# Altium schematic sheet Sheet1.SchDoc
size A
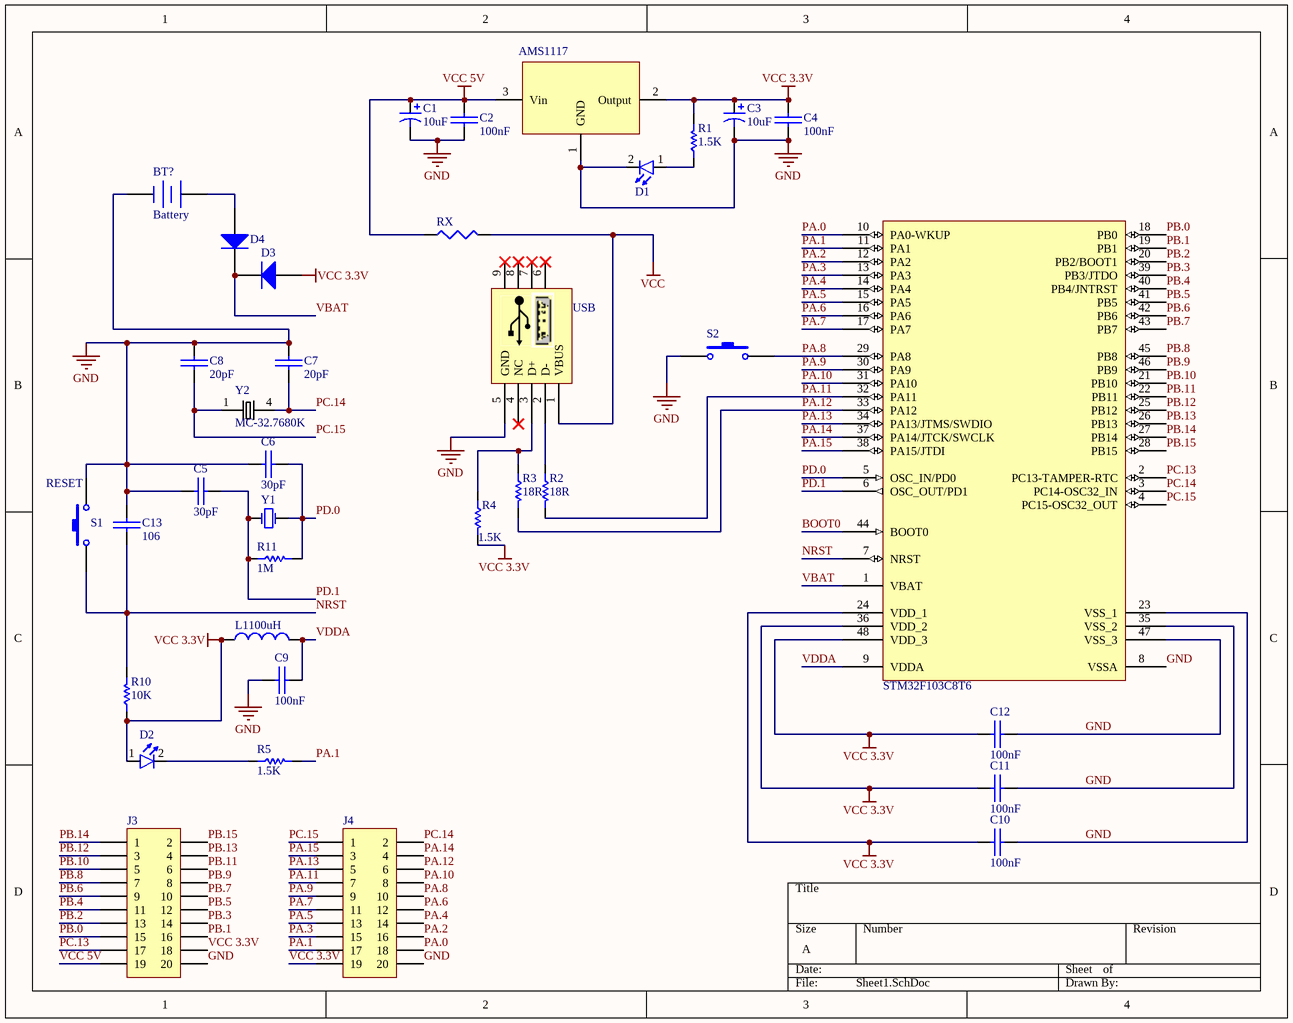
[diagram p0: Sheet1.SchDoc]

## Parts
*  AMS1117  [AMS1117 3.3]
BT?  Battery  [BAT-2]
C1  value 10uF  [C]  (hidden comment: T491C)
C2  100nF  [SMD_CAP_0805]
C3  value 10uF  [C]  (hidden comment: T491C)
C4  100nF  [SMD_CAP_0805]
C5  30pF  [SMD_CAP_0805]
C6  30pF  [SMD_CAP_0805]
C7  20pF  [SMD_CAP_0805]
C8  20pF  [SMD_CAP_0805]
C9  100nF  [SMD_CAP_0805]
C10  100nF  [SMD_CAP_0805]
C11  100nF  [SMD_CAP_0805]
C12  100nF  [SMD_CAP_0805]
C13  106  [SMD_CAP_0805]
D1  Red  [LED SMD 1206]  (value not drawn)
D2  Red  [LED SMD 1206]  (value not drawn)
D3  1N4148  [LL4148]  (value not drawn)
D4  1N4148  [LL4148]  (value not drawn)
J3  Header 10X2  [HDR2X10]  (value not drawn)
J4  Header 10X2  [HDR2X10]  (value not drawn)
L1100uH  Inductor  [INDC1608L]  (value not drawn)
R1  1.5K  [SMD_RES_0805]
R2  18R  [SMD_RES_0805]
R3  18R  [SMD_RES_0805]
R4  1.5K  [SMD_RES_0805]
R5  1.5K  [SMD_RES_0805]
R10  10K  [SMD_RES_0805]
R11  1M  [SMD_RES_0805]
RX  Res3  [RESC6332]  (value not drawn)
S1  RESET  [SW-PB]
S2  Switch PB  [SW-PB]  (value not drawn)
U?  STM32F103C8T6  [LQFP48_N]
USB  USB mini  [USB/SM0.8-6H5]  (value not drawn)
Y1  12 MHz  [Crystal SMD]  (value not drawn)
Y2  MC-32.7680K  [*OSCL550P800X320X254-4N]

## Nets
GND: *.1(GND) BT?.2(-) C1.2 C2.2(-) C3.2 C4.2(-) C5.2(-) C6.2(-) C7.1(+) C8.1(+) C9.2(-) C10.2(-) C11.2(-) C12.1(+) C13.1(+) D1.2(K) J3.20 J4.20 S1.2 S2.1 U?.8(VSSA) U?.23(VSS_1) U?.35(VSS_2) U?.47(VSS_3) USB.5(GND)
VCC: RX.2 USB.1(VBUS)
VCC 3.3V: *.2(Output) C3.1 C4.1(+) C10.1(+) C11.1(+) C12.2(-) D2.1(A) D3.1(A) J3.18 J4.19 L1100uH.1 R1.2 R4.2 R10.1 U?.24(VDD_1) U?.36(VDD_2) U?.48(VDD_3)
VCC 5V: *.3(Vin) C1.1 C2.1(+) J3.19 RX.1
BOOT0: U?.44(BOOT0)
NRST: C13.2(-) R10.2 S1.1 U?.7(NRST)
PA.0: J4.18 U?.10(PA0-WKUP)
PA.1: J4.17 R5.2 U?.11(PA1)
PA.2: J4.16 U?.12(PA2)
PA.3: J4.15 U?.13(PA3)
PA.4: J4.14 U?.14(PA4)
PA.5: J4.13 U?.15(PA5)
PA.6: J4.12 U?.16(PA6)
PA.7: J4.11 U?.17(PA7)
PA.8: J4.10 S2.2 U?.29(PA8)
PA.9: J4.9 U?.30(PA9)
PA.10: J4.8 U?.31(PA10)
PA.11: J4.7 R2.2 U?.32(PA11)
PA.12: J4.6 R3.2 U?.33(PA12)
PA.13: J4.5 U?.34(PA13/JTMS/SWDIO)
PA.14: J4.4 U?.37(PA14/JTCK/SWCLK)
PA.15: J4.3 U?.38(PA15/JTDI)
PB.0: J3.15 U?.18(PB0)
PB.1: J3.16 U?.19(PB1)
PB.2: J3.13 U?.20(PB2/BOOT1)
PB.3: J3.14 U?.39(PB3/JTDO)
PB.4: J3.11 U?.40(PB4/JNTRST)
PB.5: J3.12 U?.41(PB5)
PB.6: J3.9 U?.42(PB6)
PB.7: J3.10 U?.43(PB7)
PB.8: J3.7 U?.45(PB8)
PB.9: J3.8 U?.46(PB9)
PB.10: J3.5 U?.21(PB10)
PB.11: J3.6 U?.22(PB11)
PB.12: J3.3 U?.25(PB12)
PB.13: J3.4 U?.26(PB13)
PB.14: J3.1 U?.27(PB14)
PB.15: J3.2 U?.28(PB15)
PC.13: J3.17 U?.2(PC13-TAMPER-RTC)
PC.14: C7.2(-) J4.2 U?.3(PC14-OSC32_IN) Y2.4
PC.15: C8.2(-) J4.1 U?.4(PC15-OSC32_OUT) Y2.1
PD.0: C6.1(+) R11.2 U?.5(OSC_IN/PD0) Y1.2(OSC2)
PD.1: C5.1(+) R11.1 U?.6(OSC_OUT/PD1) Y1.1(OSC1)
VBAT: D3.2(K) D4.2(K) U?.1(VBAT)
VDDA: C9.1(+) L1100uH.2 U?.9(VDDA)
NetBT?_1: BT?.1(+) D4.1(A)
NetD1_1: D1.1(A) R1.1
NetD2_2: D2.2(K) R5.1
NetR2_1: R2.1 USB.2(D-)
NetR3_1: R3.1 R4.1 USB.3(D+)

Not connected (* = marked no-connect by the designer): USB 4(NC)* 6* 7* 8* 9*

## Library data of the parts
BT? = Battery: Multicell Battery; Published: 24-Mar-1999; LatestRevisionDate: 17-Jul-2002; LatestRevisionNote: Re-released for DXP Platform.; PackageReference: BAT-2; Publisher: Altium Limited; PackageDescription: Battery; 2 Leads
C1 C3 = T491C: Solid Tantalum Chip Capacitor, Standard T491 Series - Industrial Grade; Published: 17-Jul-2002; LatestRevisionDate: 19-Mar-2004; LatestRevisionNote: Silkscreen dimensions re-sized.; DatasheetDocument: Mar-2001; PackageDocument: Mar-2001; PackageReference: C; Publisher: Altium Limited; Code_JEITA: 6032-28; ComponentLink1Description: Manufacturer Link; ComponentLink1URL: http://www.kemet.com/; ComponentLink2Description: Datasheet; ComponentLink2URL: http://www.kemet.com/kemet/web/homepage/kechome.nsf/vapubfilesname/F3102TA.pdf/$file/F3102TA.pdf
C2 C4-C13 = Cap-Bipolar: Bipolar Capacitor; Voltage: 100V; Designer: Saeid Jorablo; Organazation: ControTec; Adding Date: 1387/12/20
  C2 C4 C9-C12: Value: 100nF
  C5 C6: Value: 30pF
  C7 C8: Value: 20pF
  C13: Value: 106
D1 D2 = LED: Designer: Saeid Jorablo; Organazation: ControTec; Adding Date: 1387/12/22; Color: Red; Size: SMD 1206
D3 D4 = Diode 1N4148: High Conductance Fast Diode; Published: 8-Jun-2000; LatestRevisionDate: 17-Jul-2002; LatestRevisionNote: Re-released for DXP Platform.; DatasheetVersion: 1997; PackageReference: DO-35; Publisher: Altium Limited; PackageDescription: Diode, Axial; Body 3.8 x 1.9 mm (LxDia. max), Lead Dia. 0.53 mm (max); Code_JEDEC: DO-204-AH; ComponentLink1Description: Manufacturer Link; ComponentLink1URL: http://www.fairchildsemi.com/; ComponentLink2Description: Datasheet; ComponentLink2URL: http://www.fairchildsemi.com/ds/1N%2F1N4148.pdf
J3 J4 = Header 10X2: Header, 10-Pin, Dual row; LatestRevisionDate: 17-Jul-2002; LatestRevisionNote: Re-released for DXP Platform.; Publisher: Altium Limited
L1100uH = Inductor: Code_IEC: 1005; Value: 10mH; Published: 8-Jun-2000; LatestRevisionDate: 29-May-2009; LatestRevisionNote: IPC-7351 Footprint Added.; PackageReference: 0402-A; Publisher: Altium Limited; PackageDescription: Chip Inductor; Code_JEITA: 0402
R1-R5 R11 = Resistor: Tolerance: 5%; Power: 1/8 W
  R1 R4 R5: Value: 1.5K
  R2 R3: Value: 18R
  R11: Value: 1M
R10 = Resistor: Tolerance: 9; Power: 1/8 W; Value: 10K
RX = Res3: Resistor; Value: 1K; Published: 8-Jun-2000; LatestRevisionDate: 29-May-2009; LatestRevisionNote: IPC-7351 Footprint Added.; PackageReference: J1-0603; Publisher: Altium Limited; PackageDescription: Chip Resistor
S1 S2 = Switch PB: Push Button Switch
U? = STM32F103C8T6: STM32 ARM-based 32-bit MCU with 64 Kbytes Flash, 48-pin LQFP, Industrial Temperature; Published: 30-May-2008; DatasheetVersion: rev6, Mar-2008; PackageVersion: Mar-2008; PackageReference: LQFP48; Publisher: Altium Limited; PackageDescription: 48-Pin Low-Profile Quad Flat Pack, 7 x 7 mm Body, 0.5 mm Pitch (LQFP48); ComponentLink1Description: Manufacturer Link; ComponentLink1URL: www.st.com/stm32; ComponentLink2Description: Datasheet; ComponentLink2URL: http://www.st.com/stonline/products/literature/ds/13587.pdf
USB = USB mini: mini USB Connector
Y1 = XTAL: XTAL Crystal; Designer: ABBAS BASEREH; Design Date: 2017-1-3; ComponentLink1Description: Datasheet; ComponentLink2Description: Reference; Mounting Technology: Surface Mount\Through-Hole; Value: 12 MHz; Status: Unreleased
Y2 = MC-306_32.7680K-A5:_ROHS: Crystal 32.7680 Khz 12.5pf Smd; MF: EPSON; MP: MC-306 32.7680K-A5: ROHS; Availability: Unavailable; SnapEDA_Link: https://www.snapeda.com/parts/MC-306%2032.7680K-A5%3A%20ROHS/EPSON/view-part/?ref=snap; Package: 4-4 Epson; Price: None; Value: *